# EAGLE design Airgap (EAGLE 6.3)
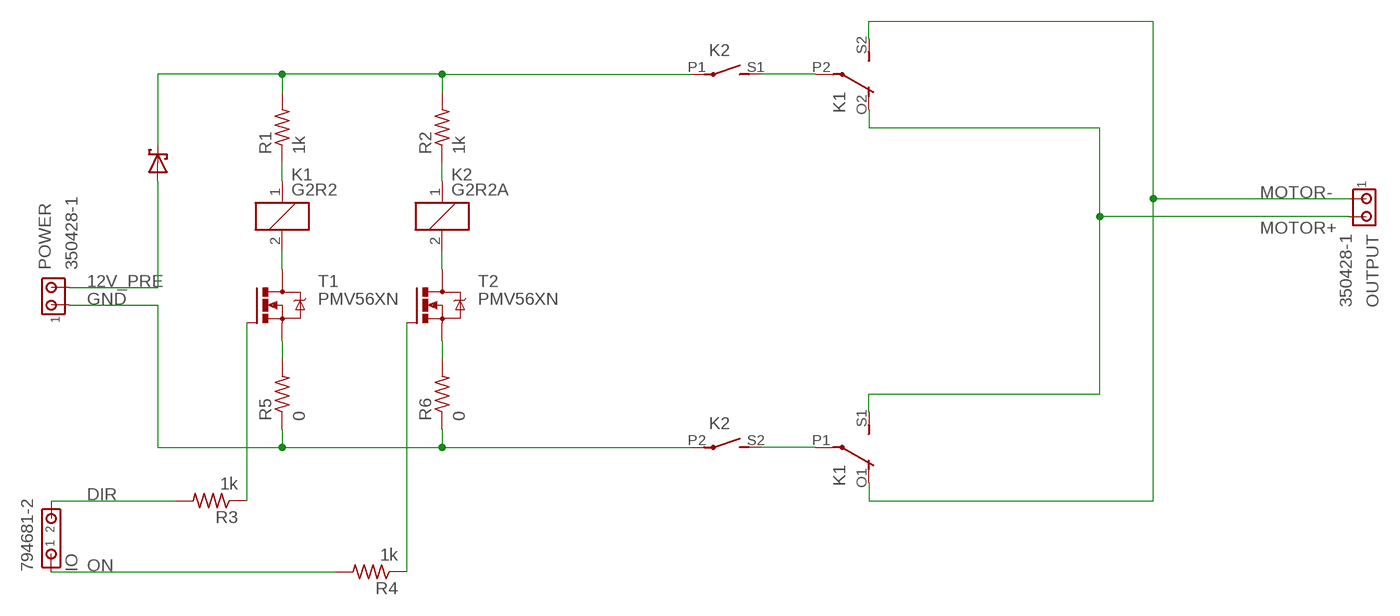
[diagram p0: schematic, sheet 1]

## Parts
D3  6A4  5KPXX  [P6T15]
IO  794681-2  [794681-2]
K1  G2R2  [G2R2]
K2  G2R2A  [G2R2A]
OUTPUT  350428-1  [350428-1]
POWER  350428-1  [350428-1]
R1  1k  RESISTORSMD1206  [R1206]
R2  1k  RESISTORSMD1206  [R1206]
R3  1k  RESISTORSMD1206  [R1206]
R4  1k  RESISTORSMD1206  [R1206]
R5  0  RESISTORSMD1206  [R1206]
R6  0  RESISTORSMD1206  [R1206]
T1  PMV56XN  N-CHANNEL_MOSFETPMV56XN,215  [SOT23]
T2  PMV56XN  N-CHANNEL_MOSFETPMV56XN,215  [SOT23]

## Nets
12V [power]: D3.C K2.P1(2:P) R1.2 R2.2
12V_PRE [power]: D3.A POWER.2
DIR: IO.2 R3.2
GND [power]: K2.P2(3:P) POWER.1 R5.1 R6.1
MOTOR+ [power]: K1.O2(3:O) K1.S1(2:S) OUTPUT.2
MOTOR- [power]: K1.O1(2:O) K1.S2(3:S) OUTPUT.1
N$1 [power]: K1.P2(3:P) K2.S1(2:S)
N$2 [power]: K1.P1(2:P) K2.S2(3:S)
N$3: K1.1 R1.1
N$4: K2.1 R2.1
N$5: K1.2 T1.3(D)
N$6: K2.2 T2.3(D)
N$7: R4.1 T2.1(G)
N$8: R3.1 T1.1(G)
N$9: R5.2 T1.2(S)
N$10: R6.2 T2.2(S)
ON: IO.1 R4.2

## Library data of the parts
D3 = diode:5KPXX: DIODE transient voltage suppressor
IO = con-amp:794681-2: Micro MATE-N-LOK Connectors grid 1.5mm Dual Row Through Hole Vertical Metal Through Hole Holddowns Source: ENG_CD_794681_E.pdf
K1 = relay:G2R2: RELAY 2 x switch, Omron; MF: OMRON COMPONENTS USA; MPN: G2R-2-DC6; OC_FARNELL: unknown; OC_NEWARK: 89C5317
K2 = relay:G2R2A: RELAY 2 x norm. open, Omron; MPN: G2R-2A-DC24; OC_FARNELL: 6985269; OC_NEWARK: 36M5257
OUTPUT = con-amp:350428-1: Universal MATE-N-LOK .250" Centerline, 600 V, 19 - 36 A max Source: http://catalog.tycoelectronics.com/ .. ENG_CD_350428_Y.pdf; NEG: -; POS: +
POWER = con-amp:350428-1: Universal MATE-N-LOK .250" Centerline, 600 V, 19 - 36 A max Source: http://catalog.tycoelectronics.com/ .. ENG_CD_350428_Y.pdf
R1-R4 = SolarJacketsADC:RESISTOR; PART_NUM: CR1206-FX-1001GLF
R5 R6 = SolarJacketsADC:RESISTOR; PART_NUM: CR1206-J/-000ELF
T1 T2 = SolarJacketsADC:N-CHANNEL_MOSFET; PART_NUM: PMV56XN,215

## Net classes
1 power: width 2.54 mm, drill 76.2 mm

## Board
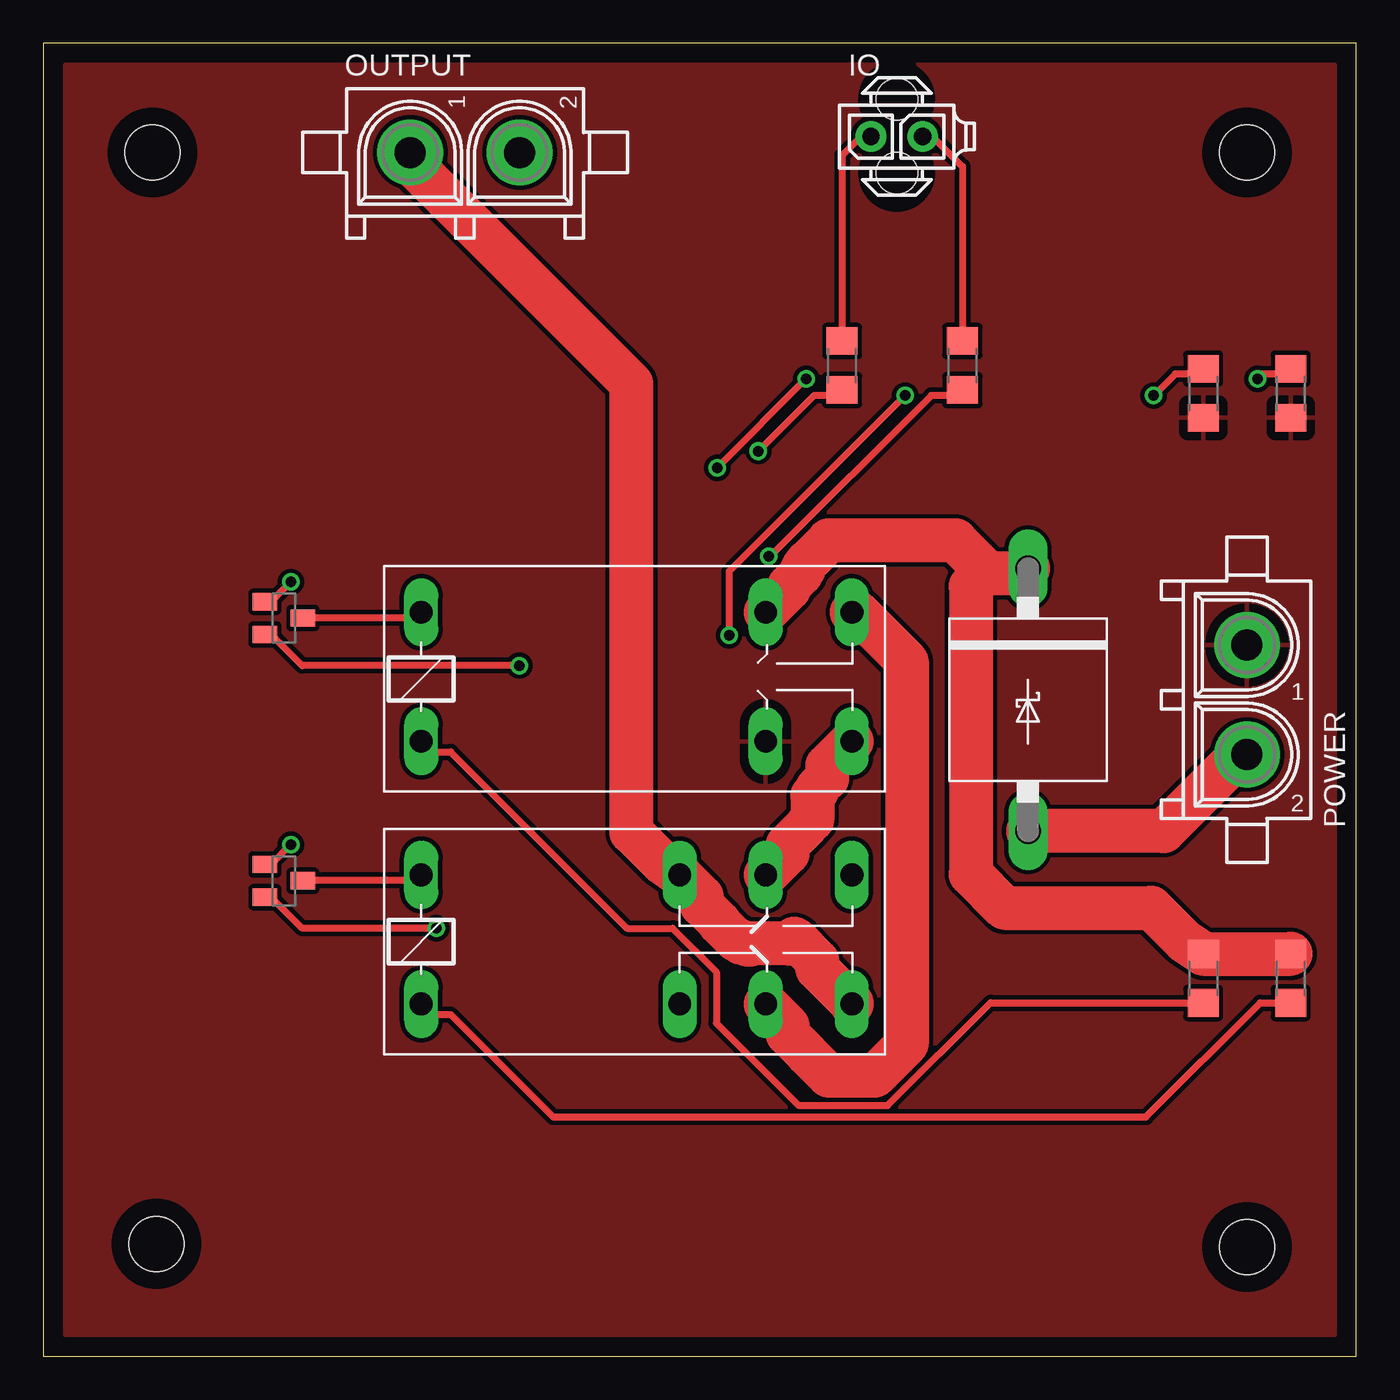
[diagram p1: board, top side]
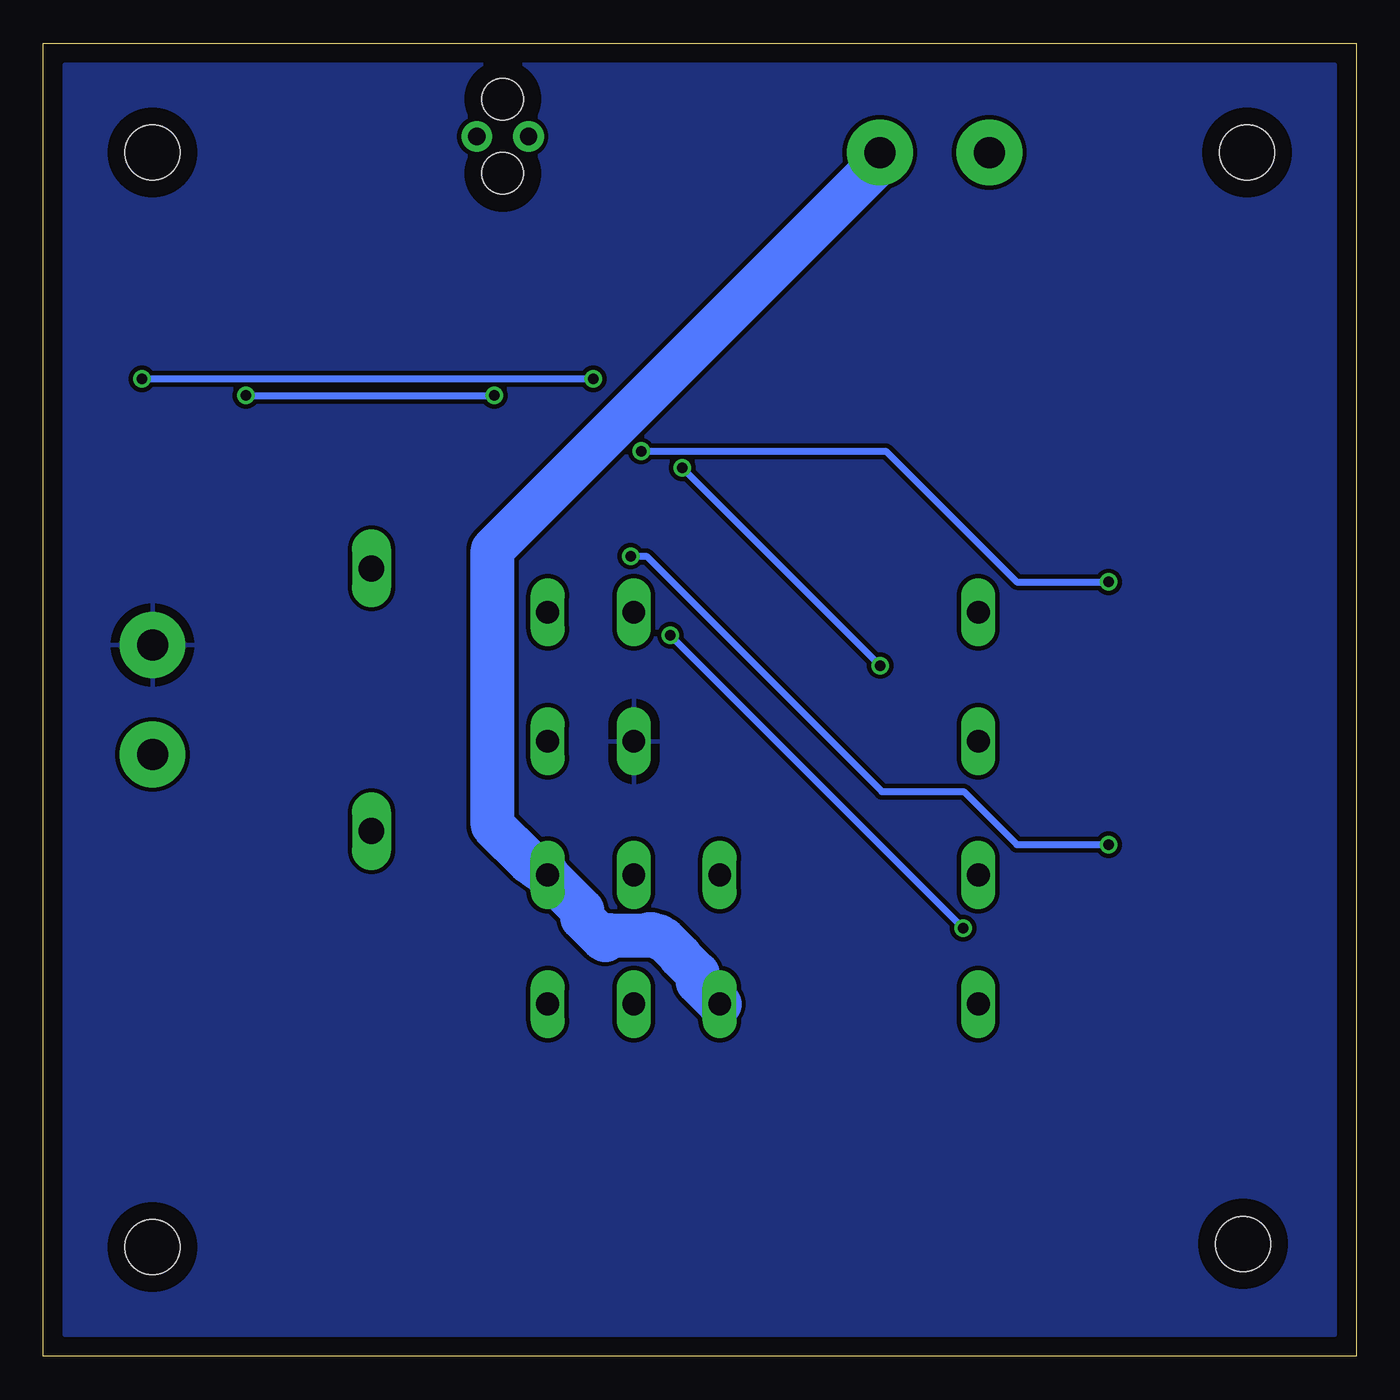
[diagram p2: board, bottom side, seen from below]

Size 76.2 x 76.2 mm. Coordinates in mm from the lower left corner, seen from the top.
Outline: 0,0 76.2,0 76.2,76.2 0,76.2 0,0
Copper layers (1*16): Top 0.035mm / dielectric 1.5mm / Bottom 0.035mm
Design rules "SJ Design Rules": minimum track width 16mil, minimum drill 24mil, track to track 10mil, track to pad 10mil, pad to pad 10mil, via to via 10mil, smd to smd 10mil, copper to edge 40mil, drill to drill 10mil, minimum pad ring 10mil, minimum via ring 8mil, stop-mask expansion 4mil, vias tented up to drill 0mil, thermal gap 20mil
Holes 3.17 mm at 6.58,6.53 69.85,69.85 69.85,6.35 6.35,69.85

### Footprints (pad centres in the part's own frame; a part is rotated, then mirrored left to right if it is on the bottom)
P6T15 = drill 1.499 long: A 7.62,0; C -7.62,0
794681-2 = drill 1 pad 1.778: 1 0,-1.5; 2 0,1.5 | hole 2.4: 2.13,0; -2.17,0
G2R2 = drill 1.321 long: 1 -2.54,-3.683; 2 -2.54,3.81; O1 12.471,3.81; O2 12.471,-3.683; P1 17.45,3.81; P2 17.45,-3.683; S1 22.454,3.81; S2 22.454,-3.683
G2R2A = drill 1.321 long: 1 -2.54,-3.683; 2 -2.54,3.81; P1 17.45,3.81; P2 17.45,-3.683; S1 22.454,3.81; S2 22.454,-3.683
350428-1 = drill 1.8 pad 3.81: 1 -3.175,0; 2 3.175,0
R1206 = smd 1.6 x 1.803: 1 -1.422,0; 2 1.422,0
SOT23 = smd 1 x 1.4: 1 -0.95,-1.1; 2 0.95,-1.1; 3 0,1.1

### Placement (x,y rotation side)
D3  57.15,38.1 270 top
IO  49.53,70.78 270 top
K1  24.47,24.13 0 top
K2  24.47,39.37 0 top
OUTPUT  24.47,69.85 0 top
POWER  69.85,38.1 270 top
R1  72.39,21.93 90 top
R2  67.31,21.93 90 top
R3  53.34,57.49 90 top
R4  46.35,57.49 90 top
R5  67.31,55.88 90 top
R6  72.39,55.88 90 top
T1  13.97,27.6 270 top
T2  13.97,42.84 270 top

### Tracks (layer width: path | path; a pad name or v marks a point on that pad's centre or on a via)
12V
  Top 2.54: 72.39,23.37 R1.2 R2.2 67.31,23.37 66.24,24.08 64.29,26.04 55.78,26.04 53.82,27.99 53.82,44.68 54.71,45.57 | 54.71,45.57 54.86,45.41 56.84,45.41 D3.C | 54.71,45.57 52.93,47.35 45.59,47.35 44.35,46.1 44.35,46.08 44.12,45.85 44.12,45.67 43.99,45.54 43.99,45.41 43.28,44.7 43.28,44.53 41.94,43.18 K2.P1
12V_PRE
  Top 2.54: D3.A 65.02,30.48 69.47,34.92 POWER.2
DIR
  Top 0.406: R3.2 53.34,69.04 51.61,70.76 51.05,70.76 IO.2
GND
  pour Top: 1.27,74.93 74.93,74.93 74.93,1.27 1.27,1.27
  pour Bottom: 1.27,74.93 74.93,74.93 74.93,1.27 1.27,1.27
MOTOR+
  Bottom 2.54: K1.O2 36.96,20.45 38.23,21.72 38.23,22.2 39.22,23.19 39.22,23.24 40.18,24.21 40.31,24.21 40.49,24.38 40.77,24.38 40.89,24.51 41.02,24.51 41.1,24.43 43.31,24.43 43.59,24.16 43.66,24.23 43.71,24.23 44.91,25.43 44.91,25.88 46.91,27.89 46.91,27.94 K1.S1 47.98,28.68 50.11,30.81 50.11,46.81 27.66,69.27 27.66,69.85 OUTPUT.2
MOTOR-
  Top 2.54: K1.S2 46.91,20.45 46.91,20.5 44.91,22.5 44.91,22.96 43.71,24.16 43.66,24.16 43.59,24.23 43.31,23.95 41.1,23.95 41.02,23.88 40.89,23.88 40.77,24 40.49,24 40.31,24.18 40.18,24.18 39.22,25.15 39.22,25.2 38.23,26.19 38.23,26.67 36.96,27.94 K1.O1 35.89,28.68 34.14,30.43 34.14,56.44 21.31,69.27 OUTPUT.1
N$1
  Top 2.54: K2.S1 47.24,43.18 50.11,40.31 50.11,18.14 48.26,16.28 45.59,16.28 44.35,17.53 44.35,17.55 43.2,18.69 43.2,19.18 41.94,20.45 K1.P2
N$2
  Top 2.54: K1.P1 41.94,27.94 43.2,29.21 43.2,29.69 44.35,30.84 44.35,30.86 44.63,31.14 44.63,32.54 44.91,32.82 44.91,32.97 45.49,33.55 45.49,34.27 46.91,35.69 K2.S2
N$3
  Top 0.406: R1.1 72.39,20.52 70.61,20.52 63.98,13.89 29.59,13.89 23.65,19.84 22.55,19.84 21.95,20.45 K1.1
N$4
  Top 0.406: R2.1 67.31,20.52 54.97,20.52 49,14.55 43.84,14.55 39.06,19.33 39.06,22.3 36.52,24.84 33.88,24.84 23.65,35.08 22.55,35.08 21.95,35.69 K2.1
N$5
  Top 0.406: T1.3 15.09,27.61 21.59,27.61 K1.2
N$6
  Top 0.406: T2.3 15.09,42.85 21.59,42.85 K2.2
N$7  (via drill 0.61)
  Top 0.406: v14.38,44.93 13.23,43.79 T2.1 | v41.5,52.53 44.73,55.75 45.74,55.75 46.08,56.08 46.35,56.08 R4.1
  Bottom 0.406: v14.38,44.93 19.71,44.93 27.3,52.53 v41.5,52.53
N$8  (via drill 0.61)
  Top 0.406: v14.38,29.69 13.23,28.55 T1.1 | v42.11,46.43 42.22,46.43 51.54,55.75 52.73,55.75 53.06,56.08 53.34,56.08 R3.1
  Bottom 0.406: v14.38,29.69 19.71,29.69 22.78,32.77 27.53,32.77 41.2,46.43 v42.11,46.43
N$9  (via drill 0.61)
  Top 0.406: v22.81,24.84 15.04,24.84 13.23,26.64 T1.2 | v39.8,41.83 39.8,45.54 v50.01,55.75 | v64.44,55.75 65.68,57 66.73,57 67.03,57.3 R5.2 | R5.2
  Bottom 0.406: v39.8,41.83 v22.81,24.84 | v64.44,55.75 v50.01,55.75
N$10  (via drill 0.61)
  Top 0.406: v27.64,40.08 15.04,40.08 13.23,41.88 T2.2 | v44.27,56.72 v39.12,51.56 | v70.46,56.72 70.74,57 71.81,57 72.11,57.3 R6.2 | R6.2
  Bottom 0.406: v39.12,51.56 v27.64,40.08 | v70.46,56.72 v44.27,56.72
ON
  Top 0.406: R4.2 46.35,69.67 47.45,70.76 48.01,70.76 IO.1

### Text on the board
tValues: SOLAR JACKETS AIR GAP BOARD / 1/8/13 REV 4